# Altium schematic sheet DD2090_4CAM_FFC_IR_Dot_Projector_IR_LED.SchDoc: =project_title
size Tabloid; PageSetup: Record=PageOptions|CenterHorizontal=True|CenterVertical=True|PrintScale=0.73|XCorrection=1.00|YCorrection=1.00|PrintKind=0|BorderSize=5000000|LeftOffset=0|BottomOffset=0|Orientation=2|PaperLength=1000|PaperWidth=1000|Scale=100|PaperSource=7|PrintQuality=-4|MediaType=1|DitherType=10|PaperKind=A4|PrintScaleMode=1; CompanyName: Luxonis Holding; DrawnBy: David Malovrh; Organization: Luxonis Holding; Address1: 1925 Harmony Park Drive; Address2: Westminster, CO; Address3: 80234; Address4: United States; SheetNumber: 12; SheetTotal: 12
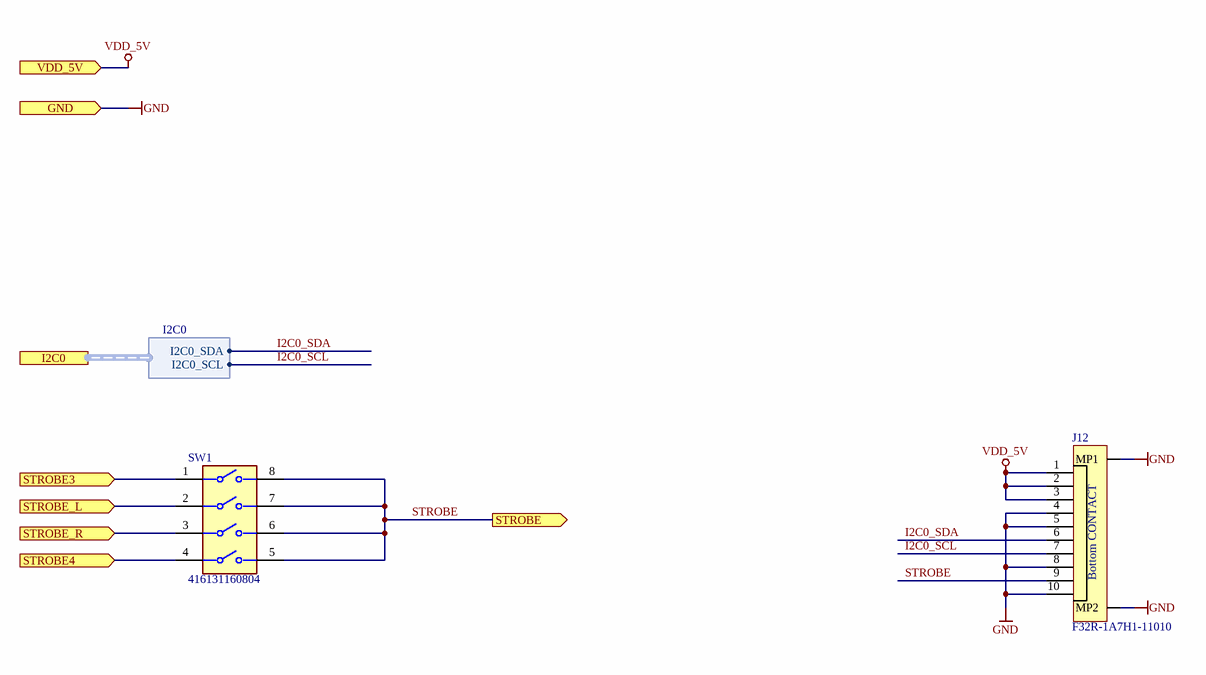
[diagram p0: DD2090_4CAM_FFC_IR_Dot_Projector_IR_LED.SchDoc]

## Parts
J12  F32R-1A7H1-11010  [F32R-1A7H1-11010]
SW1  416131160804  [FP-416131160804-MFG]

## Ports
GND (in), I2C0 (harness I2C0), STROBE3 (in), STROBE4 (in), STROBE (out), STROBE_L (in), STROBE_R (in), VDD_5V (in)

## Harnesses
I2C0: I2C0_SCL, I2C0_SDA

## Nets
GND: J12.4 J12.5 J12.8 J12.10 J12.MP1 J12.MP2 ; port GND
VDD_5V: J12.1 J12.2 J12.3 ; port VDD_5V
I2C0_SCL: J12.7 ; port I2C0.I2C0_SCL
I2C0_SDA: J12.6 ; port I2C0.I2C0_SDA
STROBE: J12.9 SW1.5 SW1.6 SW1.7 SW1.8 ; port STROBE
STROBE3: SW1.1 ; port STROBE3
STROBE4: SW1.4 ; port STROBE4
STROBE_L: SW1.2 ; port STROBE_L
STROBE_R: SW1.3 ; port STROBE_R

## Notes on the sheet
- Title
- Size:
- Date:
- Tabloid
- Number:
- Time:
- Revision:
- Sheet
- of
- Drawn by:
- (in symbol CMP-002-00101-1) Bottom CONTACT

## Library data of the parts
J12 = CMP-002-00101-1: FPC/FFC Connector Socket 10 Position 0.5mm Bottom Contact Solder Right Angle Surface Mount T/R; Manufacturer 1: Amphenol ICC / FCI; Source: DD2090_4CAM_FFC_R3M1E2.SCHLIB; Stock 1: 35427; Manufacturer Part Number 1: F32R-1A7H1-11010; Pricing 1: 1=0,53000, 10=0,44300, 50=0,44300, 100=0,38000, 500=0,33100, 1000=0,27300, 2500=0,24800, 5000=0,24000, 10000=0,23700 (USD); ComponentLink1URL: https://cdn.amphenol-icc.com/media/wysiwyg/files/drawing/f32r-f32j.pdf; ComponentLink1Description: https://cdn.amphenol-icc.com/media/wysiwyg/files/drawing/f32r-f32j.pdf; Design Item ID: F32R-1A7H1-11010; Category: FFC / FPC; RoHS: No
SW1 = CMP-011-00015-1: Slide Dip Switch, 4 Switches, SPST, Latched, 0.025A, 24VDC, 0 PCB Hole Cnt, Solder Terminal, Surface Mount-straight; Manufacturer 1: Wurth Elektronik; Current Rating: 25mA; Voltage Rating: 24V; Manufacturer Part Number 1: 416131160804; Max Operating Temperature: 85°C; RoHS Compliant: Yes; Min Operating Temperature: -40°C; Mounting Technology: SMD; Pins: 8; Max Current Rating: 25mA